# Altium schematic sheet 28.SchDoc
size 513 x 386 mm
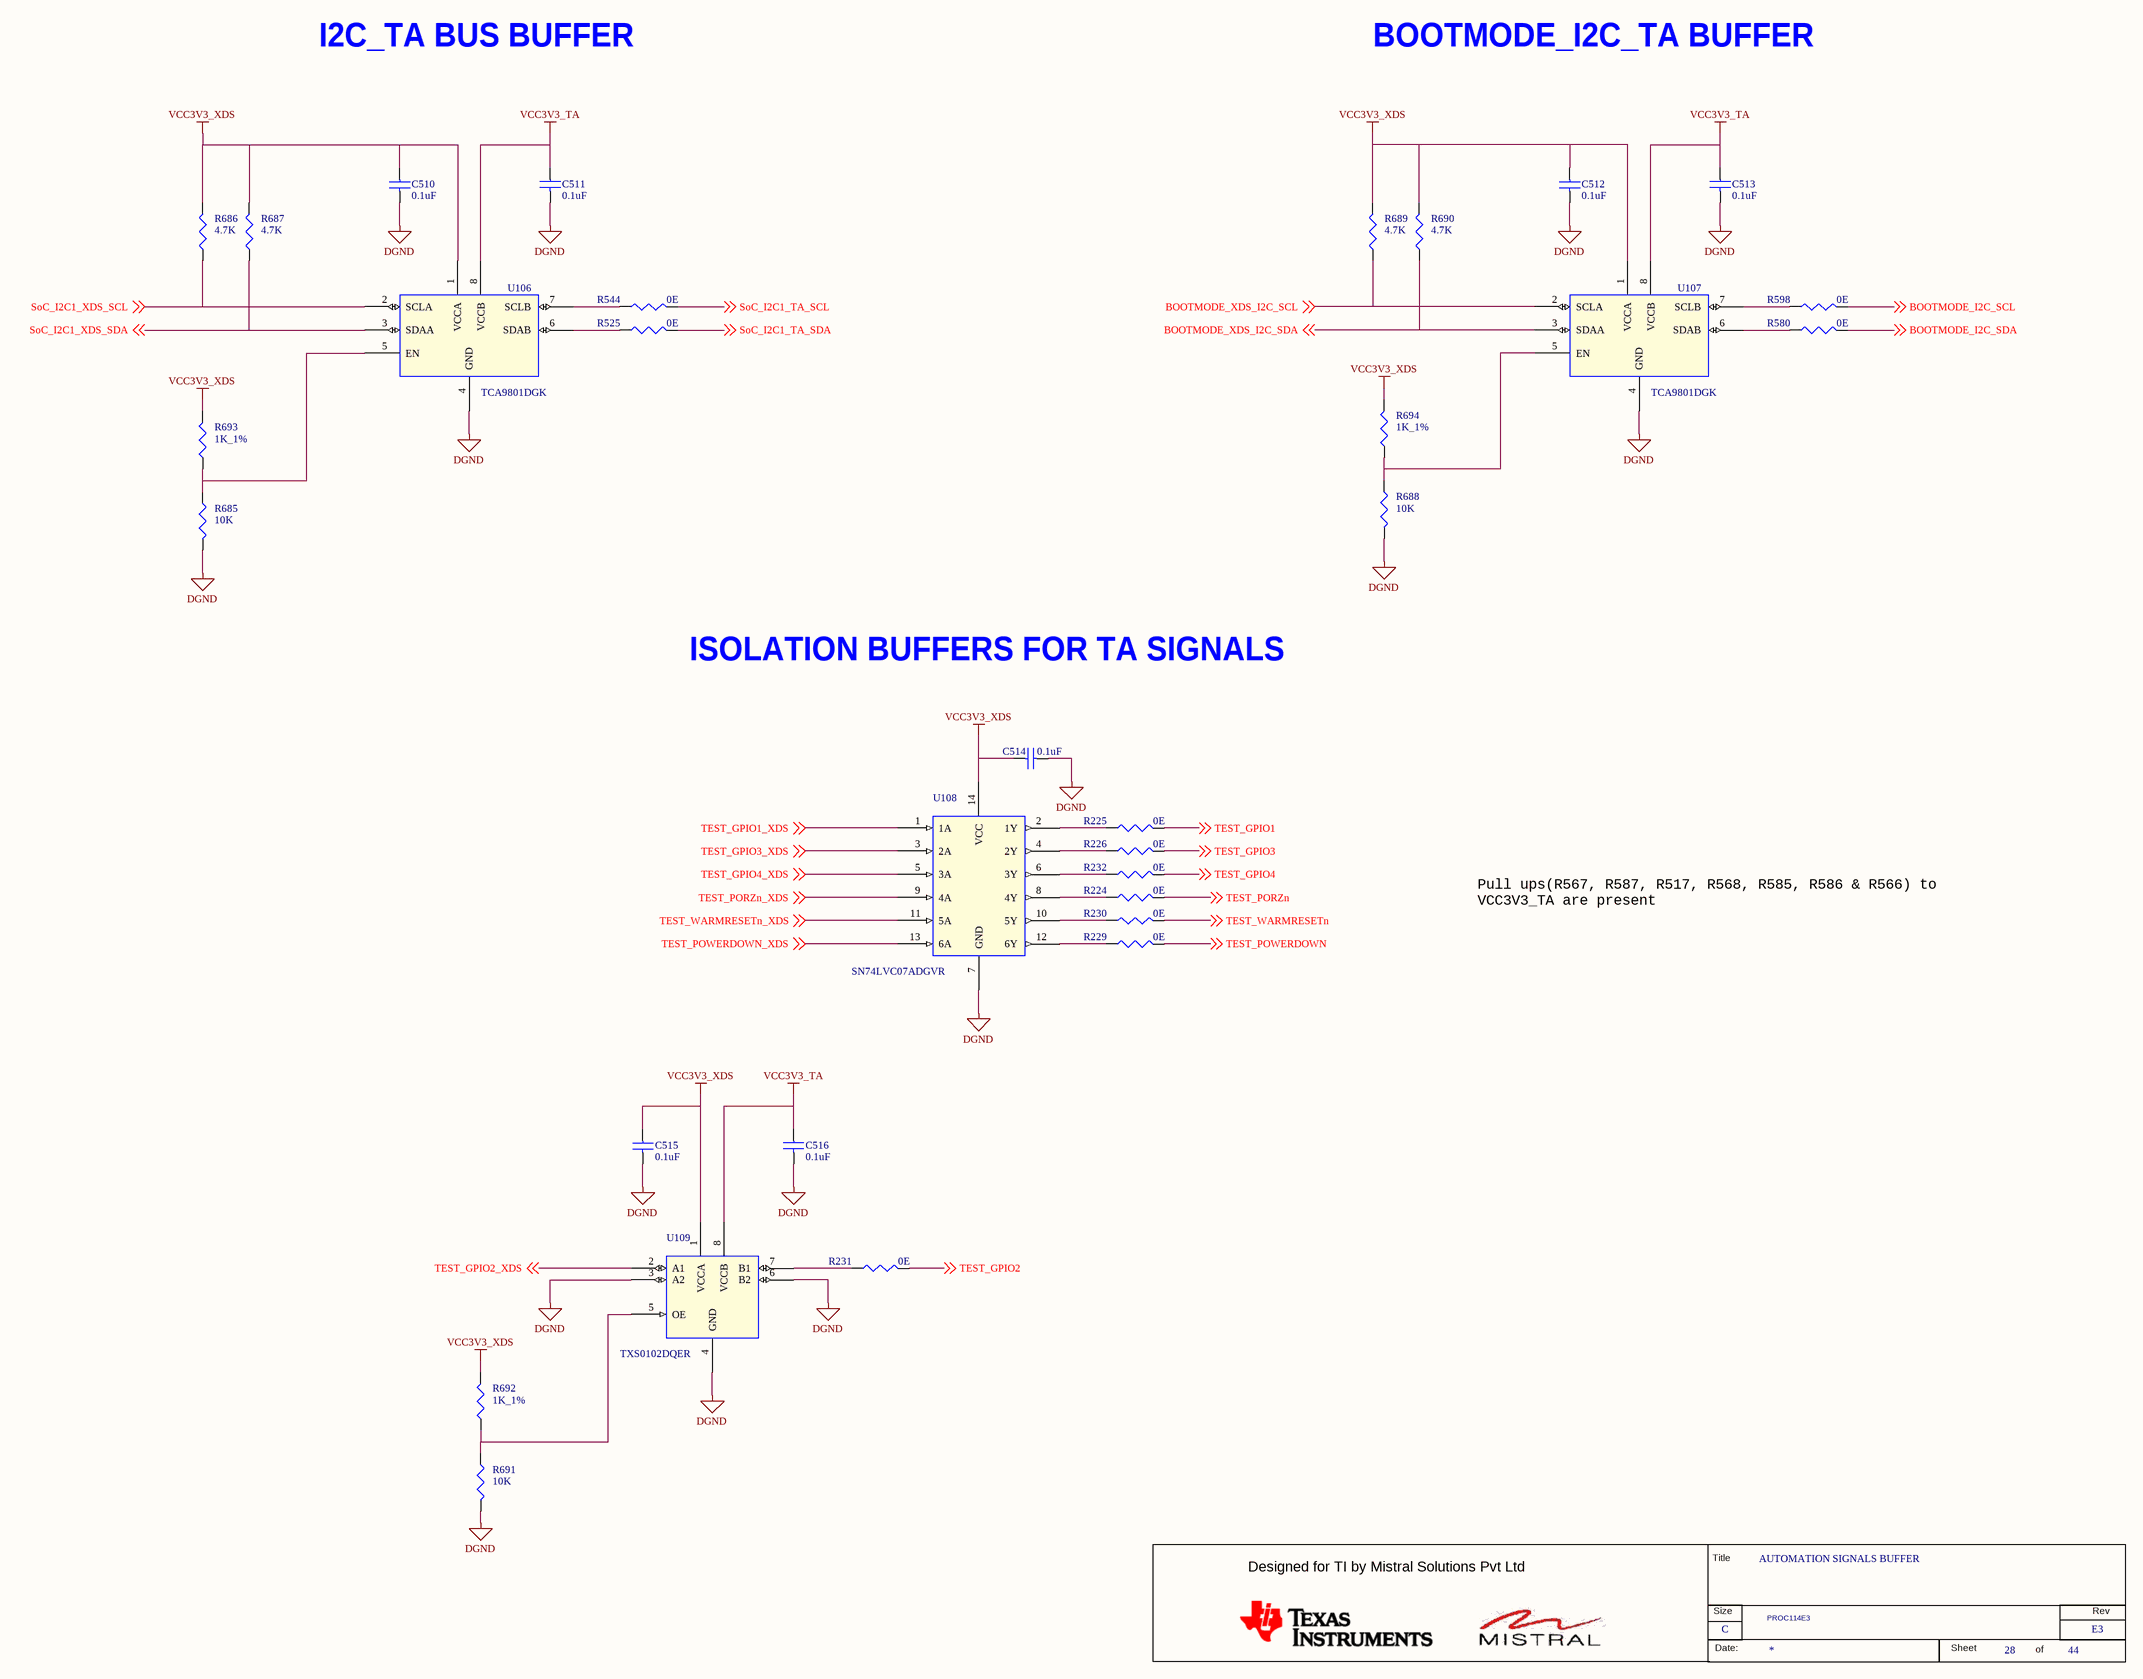
[diagram p0: 28.SchDoc]

## Parts
*  RevCode: E3  Title: AUTOMATION SIGNALS BUFFER  Page Size: C  Page Number: 28  Page Count: 44  Variant Name: PROC114E3  (hidden comment: MISTRAL_TITLEBLK_CSIZE)  (graphical)
C510  0.1uF  [CAP0201_0-5]
C511  0.1uF  [CAP0201_0-5]
C512  0.1uF  [CAP0201_0-5]
C513  0.1uF  [CAP0201_0-5]
C514  0.1uF  [CAP0201_0-5]
C515  0.1uF  [CAP0201_0-5]
C516  0.1uF  [CAP0201_0-5]
R224  0E  [RES0201_0-5]
R225  0E  [RES0201_0-5]
R226  0E  [RES0201_0-5]
R229  0E  [RES0201_0-5]
R230  0E  [RES0201_0-5]
R231  0E  [RES0201_0-5]
R232  0E  [RES0201_0-5]
R525  0E  [RES0201_0-5]
R544  0E  [RES0201_0-5]
R580  0E  [RES0201_0-5]
R598  0E  [RES0201_0-5]
R685  10K  [RES0201_0-5]
R686  4.7K  [RES0201_0-5]
R687  4.7K  [RES0201_0-5]
R688  10K  [RES0201_0-5]
R689  4.7K  [RES0201_0-5]
R690  4.7K  [RES0201_0-5]
R691  10K  [RES0201_0-5]
R692  1K_1%  [RES0402_0-5]
R693  1K_1%  [RES0402_0-5]
R694  1K_1%  [RES0402_0-5]
U106  TCA9801DGK  [VSSOP8_25-59_120X120_1-1]
U107  TCA9801DGK  [VSSOP8_25-59_120X120_1-1]
U108  SN74LVC07ADGVR  [TVSOP14_15-74_180X150_1-2]
U109  TXS0102DQER  [X2SON8_TXS0102_40X60_0-4]

## Nets
DGND: C510.2 C511.2 C512.2 C513.2 C514.2 C515.2 C516.2 R685.1 R688.1 R691.1 U106.4(GND) U107.4(GND) U108.7(GND) U109.3(A2) U109.4(GND) U109.6(B2)
VCC3V3_TA: C511.1 C513.1 C516.1 U106.8(VCCB) U107.8(VCCB) U109.8(VCCB)
VCC3V3_XDS: C510.1 C512.1 C514.1 C515.1 R686.1 R687.1 R689.1 R690.1 R692.2 R693.2 R694.2 U106.1(VCCA) U107.1(VCCA) U108.14(VCC) U109.1(VCCA)
BOOTMODE_I2C_SCL: R598.2 ; off-sheet BOOTMODE_I2C_SCL
BOOTMODE_I2C_SDA: R580.2 ; off-sheet BOOTMODE_I2C_SDA
BOOTMODE_XDS_I2C_SCL: R689.2 U107.2(SCLA) ; off-sheet BOOTMODE_XDS_I2C_SCL
BOOTMODE_XDS_I2C_SDA: R690.2 U107.3(SDAA) ; off-sheet BOOTMODE_XDS_I2C_SDA
SoC_I2C1_TA_SCL: R544.2 ; off-sheet SoC_I2C1_TA_SCL
SoC_I2C1_TA_SDA: R525.2 ; off-sheet SoC_I2C1_TA_SDA
SoC_I2C1_XDS_SCL: R686.2 U106.2(SCLA) ; off-sheet SoC_I2C1_XDS_SCL
SoC_I2C1_XDS_SDA: R687.2 U106.3(SDAA) ; off-sheet SoC_I2C1_XDS_SDA
TEST_GPIO1: R225.2 ; off-sheet TEST_GPIO1
TEST_GPIO1_XDS: U108.1(1A) ; off-sheet TEST_GPIO1_XDS
TEST_GPIO2: R231.2 ; off-sheet TEST_GPIO2
TEST_GPIO2_XDS: U109.2(A1) ; off-sheet TEST_GPIO2_XDS
TEST_GPIO3: R226.2 ; off-sheet TEST_GPIO3
TEST_GPIO3_XDS: U108.3(2A) ; off-sheet TEST_GPIO3_XDS
TEST_GPIO4: R232.2 ; off-sheet TEST_GPIO4
TEST_GPIO4_XDS: U108.5(3A) ; off-sheet TEST_GPIO4_XDS
TEST_PORZn: R224.2 ; off-sheet TEST_PORZn
TEST_PORZn_XDS: U108.9(4A) ; off-sheet TEST_PORZn_XDS
TEST_POWERDOWN: R229.2 ; off-sheet TEST_POWERDOWN
TEST_POWERDOWN_XDS: U108.13(6A) ; off-sheet TEST_POWERDOWN_XDS
TEST_WARMRESETn: R230.2 ; off-sheet TEST_WARMRESETn
TEST_WARMRESETn_XDS: U108.11(5A) ; off-sheet TEST_WARMRESETn_XDS
NetR224_1: R224.1 U108.8(4Y)
NetR225_1: R225.1 U108.2(1Y)
NetR226_1: R226.1 U108.4(2Y)
NetR229_1: R229.1 U108.12(6Y)
NetR230_1: R230.1 U108.10(5Y)
NetR231_1: R231.1 U109.7(B1)
NetR232_1: R232.1 U108.6(3Y)
NetR525_1: R525.1 U106.6(SDAB)
NetR544_1: R544.1 U106.7(SCLB)
NetR580_1: R580.1 U107.6(SDAB)
NetR598_1: R598.1 U107.7(SCLB)
NetR685_2: R685.2 R693.1 U106.5(EN)
NetR688_2: R688.2 R694.1 U107.5(EN)
NetR691_2: R691.2 R692.1 U109.5(OE)

## Notes on the sheet
- I2C_TA BUS BUFFER
- BOOTMODE_I2C_TA BUFFER
- ISOLATION BUFFERS FOR TA SIGNALS
- Pull ups(R567, R587, R517, R568, R585, R586 & R566) to
  VCC3V3_TA are present
- (in symbol MISTRAL_TITLEBLK_CSIZE) Title; Designed for TI by Mistral Solutions Pvt Ltd; Size; Rev; Date:; Sheet; of

## Library data of the parts
* = MISTRAL_TITLEBLK_CSIZE: Issue: 1.0; Page Create Date: March  8, 1995; Page Modify Date: *
C510 C513 C516 = CAP_Dup2: CAP CERAMIC 0.1uF 16V 10% X5R 0201; Alt_Mfr_part_number: CC0402KRX5R8BB104; Mistral Part No: 120009030072-R; Mfr_name: MURATA; Mfr_part_number: GRM033R61C104KE14D; Part_type: CAPACITORS\CERAMIC; Alt_Mfr_name: YAGEO AMERICA; Project: TI_MAXIE_CPB; Wattage: NA; Customs_HS_Code: 85322990; Custom_Duty: 15%; Tolerance: 10%; Voltage: 16V; Package: 0201; Distributor_name: DIGIKEY; Distributor_part_number: 490-14305-1-ND; Height: 0.33MM; Weight: 0.33mg; Temperature: -55°C+85°C; Datasheet: Y:\MIS_DATABASE\DATASHEETS\CAPACITORS\GRM033R61C104KE14.PDF; Crtd /date: MANIRAJA/230118; Chkd/date: MANIRAJA/230118; MECHANICAL 3D STEP FILE: CAP0201_0-5; Library Ref: CAP; Footprint Ref: CAP0201_0-5; Library Path: Y:\MIS_DATABASE\Library\ALTIUM_TOOL\SCHEMATICS_PARTS\MS_DISCRETE_Library.schlib; Footprint Path: Y:\MIS_DATABASE\Library\ALTIUM_TOOL\PCB_FOOTPRINTS\Altium_Footprint_Lib.PcbLib; PCB Footprint: CAP0201_0-5
C511 C512 C514 C515 = CAP_Dup2: CAP CERAMIC 0.1uF 16V 10% X5R 0201; Alt_Mfr_name: YAGEO AMERICA; Part_type: CAPACITORS\CERAMIC; Mfr_part_number: GRM033R61C104KE14D; Mfr_name: MURATA; Mistral Part No: 120009030072-R; Alt_Mfr_part_number: CC0402KRX5R8BB104; Custom_Duty: 15%; Customs_HS_Code: 85322990; Wattage: NA; Project: TI_MAXIE_CPB; Footprint Path: Y:\MIS_DATABASE\Library\ALTIUM_TOOL\PCB_FOOTPRINTS\Altium_Footprint_Lib.PcbLib; Library Path: Y:\MIS_DATABASE\Library\ALTIUM_TOOL\SCHEMATICS_PARTS\MS_DISCRETE_Library.schlib; Footprint Ref: CAP0201_0-5; Library Ref: CAP; MECHANICAL 3D STEP FILE: CAP0201_0-5; Chkd/date: MANIRAJA/230118; Crtd /date: MANIRAJA/230118; Datasheet: Y:\MIS_DATABASE\DATASHEETS\CAPACITORS\GRM033R61C104KE14.PDF; Temperature: -55°C+85°C; Weight: 0.33mg; Height: 0.33MM; Distributor_part_number: 490-14305-1-ND; Distributor_name: DIGIKEY; Package: 0201; Voltage: 16V; Tolerance: 10%; PCB Footprint: CAP0201_0-5
R224 R226 R229 R231 R232 = RESISTOR_Dup6: RES 0E 1/20W 5% 0201; Part_type: RESISTORS\FIXED; Mfr_part_number: RC0201JR-070RL; Mfr_name: YAGEO AMERICA; Mistral Part No: 110010070067-R; Custom_Duty: 15%; Customs_HS_Code: 85332119; Voltage: NA; Project: PB_BUGBASE; Footprint Path: Y:\MIS_DATABASE\Library\ALTIUM_TOOL\PCB_FOOTPRINTS\Altium_Footprint_Lib.PcbLib; Library Path: Y:\MIS_DATABASE\Library\ALTIUM_TOOL\SCHEMATICS_PARTS\MS_DISCRETE_Library.schlib; MECHANICAL 3D STEP FILE: RES0201_0-5; Chkd/date: NAVEED/301214; Crtd /date: MUDDU/120710; Datasheet: Y:\MIS_DATABASE\DATASHEETS\RESISTORS\RCXXXXL-SER_MAR18.PDF; Temperature: -55°C+125°C; Weight: 0.17mg; Height: 0.26MM; Library Ref: RESISTOR; Distributor_part_number: 311-0.0NCT-ND; Distributor_name: DIGIKEY; Package: 0201; Wattage: 1/20W; Tolerance: 5%; Footprint Ref: RES0201_0-5; PCB Footprint: RES0201_0-5
R225 R230 R525 R544 R580 R598 = RESISTOR_Dup6: RES 0E 1/20W 5% 0201; Mistral Part No: 110010070067-R; Mfr_name: YAGEO AMERICA; Mfr_part_number: RC0201JR-070RL; Part_type: RESISTORS\FIXED; Project: PB_BUGBASE; Voltage: NA; Customs_HS_Code: 85332119; Custom_Duty: 15%; Footprint Ref: RES0201_0-5; Tolerance: 5%; Wattage: 1/20W; Package: 0201; Distributor_name: DIGIKEY; Distributor_part_number: 311-0.0NCT-ND; Library Ref: RESISTOR; Height: 0.26MM; Weight: 0.17mg; Temperature: -55°C+125°C; Datasheet: Y:\MIS_DATABASE\DATASHEETS\RESISTORS\RCXXXXL-SER_MAR18.PDF; Crtd /date: MUDDU/120710; Chkd/date: NAVEED/301214; MECHANICAL 3D STEP FILE: RES0201_0-5; Library Path: Y:\MIS_DATABASE\Library\ALTIUM_TOOL\SCHEMATICS_PARTS\MS_DISCRETE_Library.schlib; Footprint Path: Y:\MIS_DATABASE\Library\ALTIUM_TOOL\PCB_FOOTPRINTS\Altium_Footprint_Lib.PcbLib; PCB Footprint: RES0201_0-5
R685 R688 R691 = RESISTOR_Dup6: RES 10K 1/20W 5% 0201; Mistral Part No: 110010070051-R; Mfr_name: YAGEO AMERICA; Mfr_part_number: RC0201JR-0710KL; Part_type: RESISTORS\FIXED; Project: GOLDEN-I LITE; Voltage: NA; Customs_HS_Code: 85332119; Custom_Duty: 15%; PCB Footprint: RES0201_0-5; Footprint Path: Y:\MIS_DATABASE\Library\ALTIUM_TOOL\PCB_FOOTPRINTS\Altium_Footprint_Lib.PcbLib; Library Path: Y:\MIS_DATABASE\Library\ALTIUM_TOOL\SCHEMATICS_PARTS\MS_DISCRETE_Library.schlib; Footprint Ref: RES0201_0-5; Library Ref: RESISTOR; Tolerance: 5%; Wattage: 1/20W; Package: 0201; Distributor_name: DIGIKEY; Distributor_part_number: 311-10KNCT-ND; Height: 0.26MM; Weight: 0.17mg; Temperature: -55°C+125°C; Datasheet: Y:\MIS_DATABASE\DATASHEETS\RESISTORS\RCXXXXL-SER_MAR18.PDF; Crtd /date: MANIRAJA/050517; Chkd/date: MANIRAJA/050517; MECHANICAL 3D STEP FILE: RES0201_0-5
R686 R687 = RESISTOR_Dup6: RES 4.7K 1/20W 5% 0201; Part_type: RESISTORS\FIXED; Mfr_part_number: RC0201JR-074K7L; Mfr_name: YAGEO AMERICA; Mistral Part No: 110021090007-R; Custom_Duty: 15%; Customs_HS_Code: 85332119; Voltage: NA; Project: TI_AM62x SKEVM_BRD; Footprint Path: Y:\MIS_DATABASE\Library\ALTIUM_TOOL\PCB_FOOTPRINTS\Altium_Footprint_Lib.PcbLib; Library Path: Y:\MIS_DATABASE\Library\ALTIUM_TOOL\SCHEMATICS_PARTS\MS_DISCRETE_Library.schlib; MECHANICAL 3D STEP FILE: RES0201_0-5; Chkd/date: MANIRAJA/200921; Crtd /date: ALVY/200921; Datasheet: Y:\MIS_DATABASE\DATASHEETS\RESISTORS\RCXXXXL-SER_MAR18.PDF; Temperature: -55°C+125°C; Weight: 0.17mg; Height: 0.26MM; Library Ref: RESISTOR; Distributor_part_number: 311-4.7KNCT-ND; Distributor_name: DIGIKEY; Package: 0201; Wattage: 1/20W; Tolerance: 5%; Footprint Ref: RES0201_0-5; PCB Footprint: RES0201_0-5
R689 R690 = RESISTOR_Dup6: RES 4.7K 1/20W 5% 0201; Mistral Part No: 110021090007-R; Mfr_name: YAGEO AMERICA; Mfr_part_number: RC0201JR-074K7L; Part_type: RESISTORS\FIXED; Project: TI_AM62x SKEVM_BRD; Voltage: NA; Customs_HS_Code: 85332119; Custom_Duty: 15%; Footprint Ref: RES0201_0-5; Tolerance: 5%; Wattage: 1/20W; Package: 0201; Distributor_name: DIGIKEY; Distributor_part_number: 311-4.7KNCT-ND; Library Ref: RESISTOR; Height: 0.26MM; Weight: 0.17mg; Temperature: -55°C+125°C; Datasheet: Y:\MIS_DATABASE\DATASHEETS\RESISTORS\RCXXXXL-SER_MAR18.PDF; Crtd /date: ALVY/200921; Chkd/date: MANIRAJA/200921; MECHANICAL 3D STEP FILE: RES0201_0-5; Library Path: Y:\MIS_DATABASE\Library\ALTIUM_TOOL\SCHEMATICS_PARTS\MS_DISCRETE_Library.schlib; Footprint Path: Y:\MIS_DATABASE\Library\ALTIUM_TOOL\PCB_FOOTPRINTS\Altium_Footprint_Lib.PcbLib; PCB Footprint: RES0201_0-5
R692 R694 = RESISTOR_Dup4: RES 1K 1/10W 1% 0402; Part_type: RESISTORS\FIXED; Mfr_part_number: ERJ-2RKF1001X; Mfr_name: PANASONIC-ECG; Mistral Part No: 110009030411-R; Custom_Duty: 15%; Customs_HS_Code: 85332119; Voltage: NA; Project: VOCERA; PCB Footprint: RES0402_0-5; Chkd/date: VASANTHA/281216; Crtd /date: MAZHAR/150506; Datasheet: Y:\MIS_DATABASE\DATASHEETS\RESISTORS\PAN-ERJSER_NOV17.PDF; Temperature: -55°C+155°C; Weight: 0.8mg; Height: 0.40MM; Distributor_part_number: P1.00KLCT-ND; Distributor_name: DIGIKEY; Package: 0402; Wattage: 1/10W; Tolerance: 1%; Library Ref: RESISTOR; Footprint Ref: RES0402_0-5; MECHANICAL 3D STEP FILE: RES0402_0-5; Library Path: Y:\MIS_DATABASE\Library\ALTIUM_TOOL\SCHEMATICS_PARTS\MS_DISCRETE_Library.schlib; Footprint Path: Y:\MIS_DATABASE\Library\ALTIUM_TOOL\PCB_FOOTPRINTS\Altium_Footprint_Lib.PcbLib
R693 = RESISTOR_Dup4: RES 1K 1/10W 1% 0402; Mistral Part No: 110009030411-R; Mfr_name: PANASONIC-ECG; Mfr_part_number: ERJ-2RKF1001X; Part_type: RESISTORS\FIXED; Project: VOCERA; Voltage: NA; Customs_HS_Code: 85332119; Custom_Duty: 15%; PCB Footprint: RES0402_0-5; Footprint Path: Y:\MIS_DATABASE\Library\ALTIUM_TOOL\PCB_FOOTPRINTS\Altium_Footprint_Lib.PcbLib; Library Path: Y:\MIS_DATABASE\Library\ALTIUM_TOOL\SCHEMATICS_PARTS\MS_DISCRETE_Library.schlib; MECHANICAL 3D STEP FILE: RES0402_0-5; Footprint Ref: RES0402_0-5; Library Ref: RESISTOR; Tolerance: 1%; Wattage: 1/10W; Package: 0402; Distributor_name: DIGIKEY; Distributor_part_number: P1.00KLCT-ND; Height: 0.40MM; Weight: 0.8mg; Temperature: -55°C+155°C; Datasheet: Y:\MIS_DATABASE\DATASHEETS\RESISTORS\PAN-ERJSER_NOV17.PDF; Crtd /date: MAZHAR/150506; Chkd/date: VASANTHA/281216
U106 U107 = TCA9801DGK_VSSOP8: IC LEVEL TRANSLATING I2C BUS BUFFER/REPEATER VSSOP8; Part_type: ICS\INTERFACE\LEVEL TRANSLATOR; Mfr_part_number: TCA9801DGKT; Mfr_name: TEXAS INSTRUMENTS; Mistral Part No: 141018070002-R; Custom_Duty: 15%; Customs_HS_Code: 85423100; Wattage: NA; Project: DARE_RFAM_RF; PCB Footprint: VSSOP8_25-59_120X120_1-1; Footprint Path: Y:\MIS_DATABASE\Library\ALTIUM_TOOL\PCB_FOOTPRINTS\Altium_Footprint_Lib.PcbLib; Library Path: Y:\MIS_DATABASE\Library\ALTIUM_TOOL\SCHEMATICS_PARTS\MS_MISCINTERFACE_Library.schlib; MECHANICAL 3D STEP FILE: VSSOP8_25-59_120X120_1-1; Chkd/date: MANIRAJA/020718; Crtd /date: MANIRAJA/020718; Datasheet: Y:\MIS_DATABASE\DATASHEETS\ICS\INTERFACE\TCA9801DGK.PDF; Temperature: -40°C+85°C; Weight: 20mg; Height: 1.10MM; Library Ref: TCA9801DGK_VSSOP8; Distributor_part_number: 296-46571-1-ND; Distributor_name: DIGIKEY; Package: VSSOP8; Voltage: NA; Tolerance: NA; Footprint Ref: VSSOP8_25-59_120X120_1-1
U108 = 74HC7014X_SOIC14: IC HEX BUFFER AND DRIVER WITH OPEN DRAIN OUTPUT TVSOP14; Part_type: ICS\DIGITAL\COMBINATIONAL; Mfr_name: TEXAS INSTRUMENTS; Mistral Part No: 141022040005-R; Custom_Duty: 15%; Customs_HS_Code: 85423100; Wattage: NA; Project: TI_AM62x_SKEVM_BRD; Footprint Path: Y:\MIS_DATABASE\Library\ALTIUM_TOOL\PCB_FOOTPRINTS\Altium_Footprint_Lib.PcbLib; Library Path: Y:\MIS_DATABASE\Library\ALTIUM_TOOL\SCHEMATICS_PARTS\MS_COMBINATIONAL_Library.schlib; MECHANICAL 3D STEP FILE: TVSOP14_15-74_180X150_1-2; Chkd/date: ALVY/070422; Crtd /date: TAMILARASU/070422; Datasheet: Y:\MIS_DATABASE\DATASHEETS\ICS\DIGITAL\COMBINATIONAL\SN74LVC07A.PDF; Temperature: -40°C+125°C; Weight: 41.8mg; Height: 1.20MM; Library Ref: 74HC7014X_SOIC14; Distributor_part_number: 296-8440-1-ND; Distributor_name: DIGIKEY; Package: TVSOP14; Voltage: NA; Tolerance: NA; Mfr_part_number: SN74LVC07ADGVR; Footprint Ref: TVSOP14_15-74_180X150_1-2; PCB Footprint: TVSOP14_15-74_180X150_1-2
U109 = TXS0102DQX_SON8: IC 2-BIT BI-DIR VOLTAGE-LEVEL TRANSLATOR FOR OPEN-DRAIN AND PUSH-PULL X2SON8; Part_type: ICS\INTERFACE\LEVEL TRANSLATOR; Mfr_name: TEXAS INSTRUMENTS; Mistral Part No: 141012050010-R; Custom_Duty: 15%; Customs_HS_Code: 85423100; Wattage: NA; Project: GEN_3-8_DB; PCB Footprint: X2SON8_TXS0102_40X60_0-4; Footprint Path: Y:\MIS_DATABASE\Library\ALTIUM_TOOL\PCB_FOOTPRINTS\Altium_Footprint_Lib.PcbLib; Library Path: Y:\MIS_DATABASE\Library\ALTIUM_TOOL\SCHEMATICS_PARTS\MS_MISCINTERFACE_Library.schlib; MECHANICAL 3D STEP FILE: X2SON8_TXS0102_40X60_0-4; Chkd/date: MANIRAJA/010719; Crtd /date: CHAITHANYA230512; Datasheet: Y:\MIS_DATABASE\DATASHEETS\ICS\INTERFACE\TXS0102-SER.PDF; Temperature: -40°C+85°C; Weight: 1.2mg; Height: 0.40MM; Library Ref: TXS0102DQX_SON8; Distributor_part_number: 296-28368-1-ND; Distributor_name: DIGIKEY; Package: X2SON8; Voltage: NA; Tolerance: NA; Mfr_part_number: TXS0102DQER; Footprint Ref: X2SON8_TXS0102_40X60_0-4